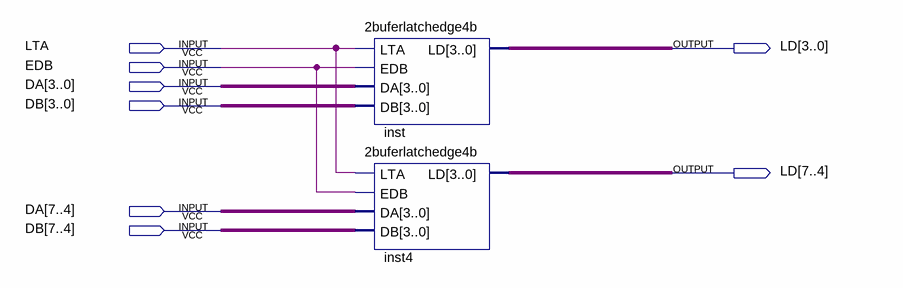
[diagram p0: schematic sheet]
// Quartus schematic 2buferlatchedge8b.bdf as structural Verilog: 2 symbols, 8 pins
module \2buferlatchedge8b  (
  input  LTA,
  input  EDB,
  input  [7:0] DA,
  input  [7:0] DB,
  output [7:0] LD
);

  \2buferlatchedge4b  inst (.LTA(LTA), .EDB(EDB), .DA(DA[3:0]), .DB(DB[3:0]), .LD(LD[3:0]));
  \2buferlatchedge4b  inst4 (.LTA(LTA), .EDB(EDB), .DA(DA[7:4]), .DB(DB[7:4]), .LD(LD[7:4]));
endmodule
